# EAGLE design rapidshark_motor_lulz (EAGLE 6.5.0)
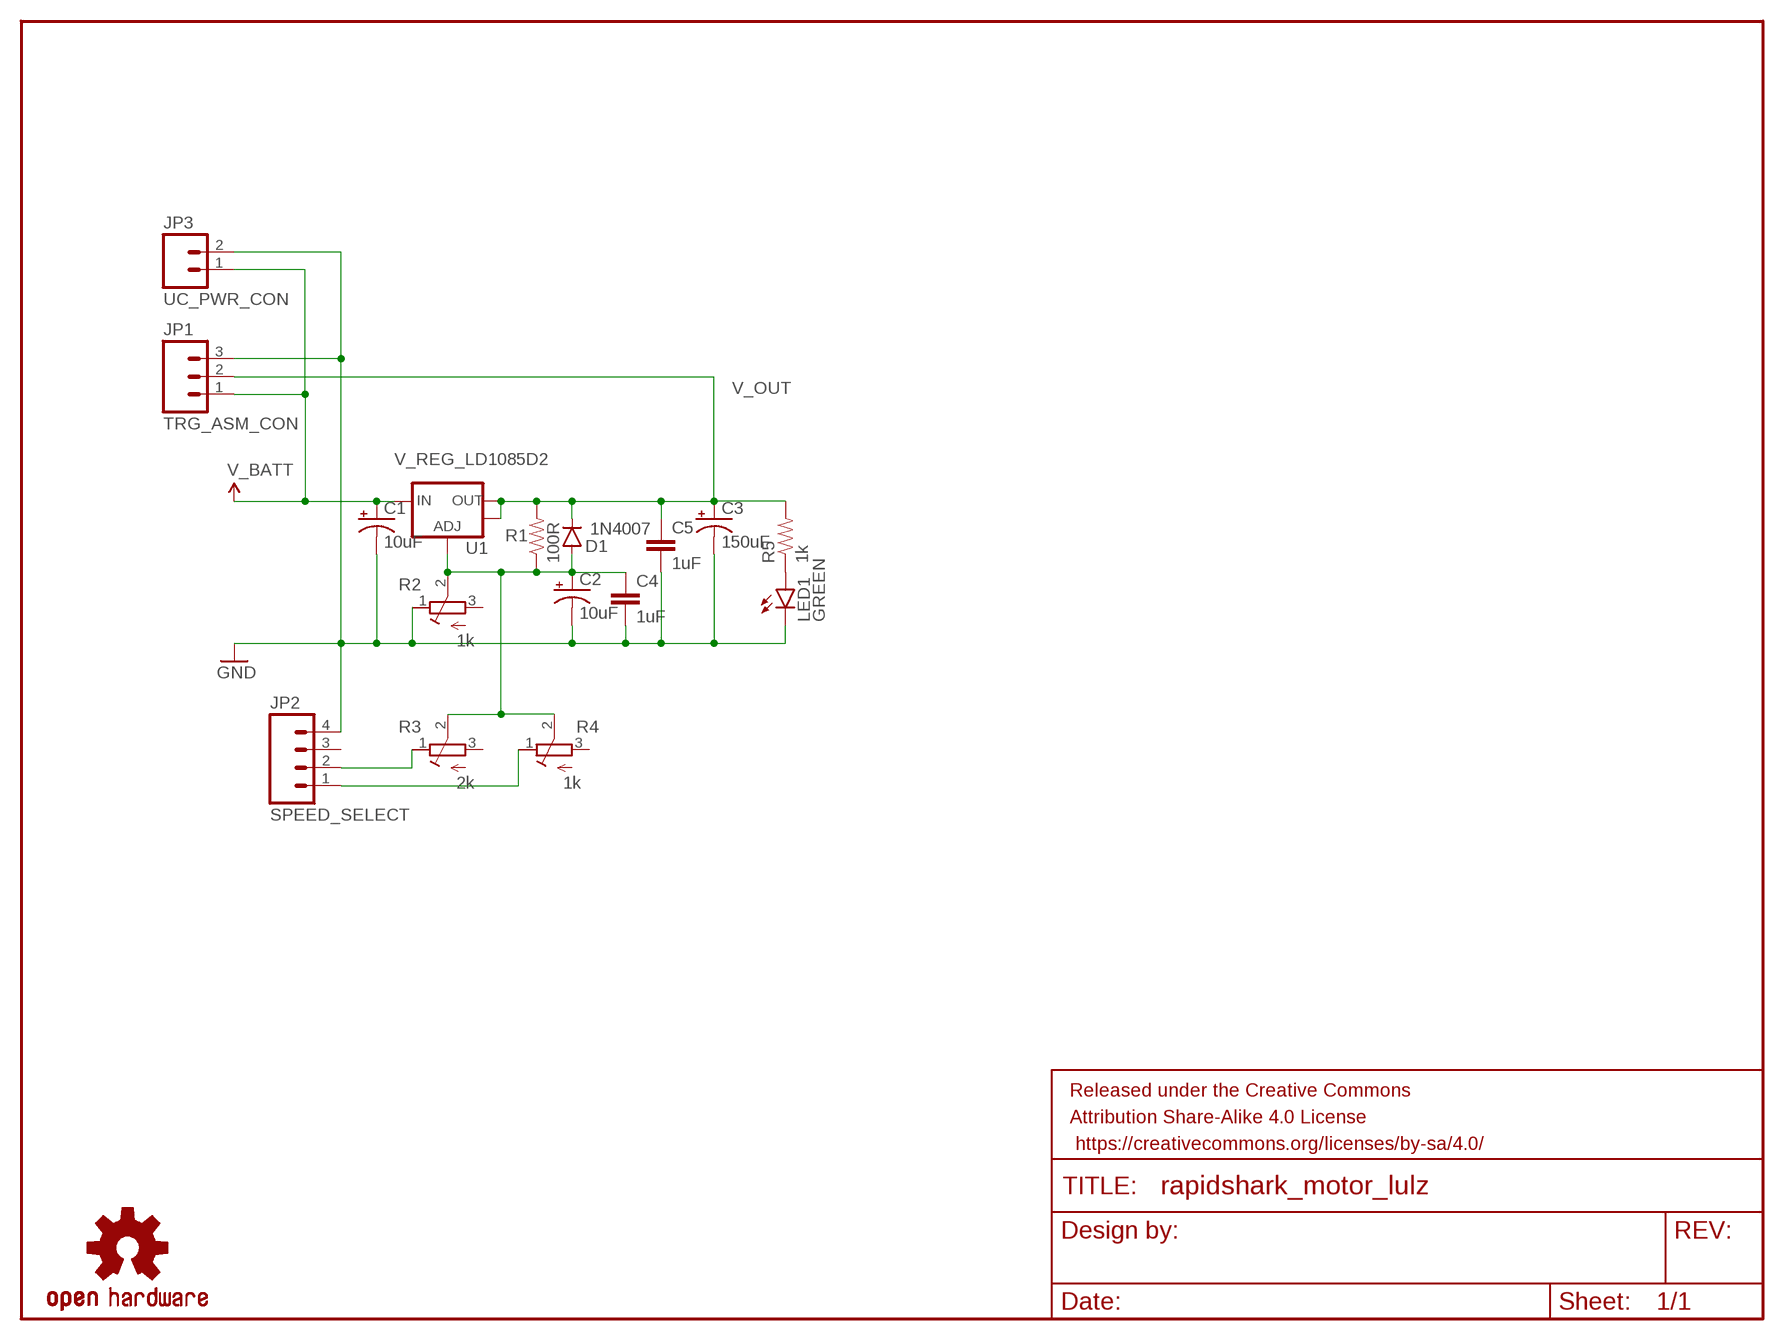
[diagram p0: schematic, sheet 1]

## Parts
C1  10uF  CPOL-USE2-5  [E2-5]
C2  10uF  CPOL-USE2-5  [E2-5]
C3  150uF  CPOL-USTT5D11L  [TT5D11L]
C4  1uF  CAPPTH  [CAP-PTH-SMALL]
C5  1uF  CAPPTH  [CAP-PTH-SMALL]
D1  1N4007  DIODEPTH  [DIODE-1N4001]
FRAME1  FRAME-LETTER  [CREATIVE_COMMONS]
JP1  TRG_ASM_CON  M03-SCREW-5MM  [SCREWTERMINAL-5MM-3]
JP2  SPEED_SELECT  M04PTH  [1X04]
JP3  UC_PWR_CON  M02PTH  [1X02]
LED1  GREEN  LED3MM  [LED3MM]
LOGO1  OSHW-LOGOS  [OSHW-LOGO-S]
R1  100R  RESISTORAXIAL-0.3  [AXIAL-0.3]
R2  1k  R-TRIMMT93XA  [RTRIMT93XA]
R3  2k  R-TRIMMT93XA  [RTRIMT93XA]
R4  1k  R-TRIMMT93XA  [RTRIMT93XA]
R5  1k  RESISTORAXIAL-0.3  [AXIAL-0.3]
U1  V_REG_LD1085D2  [D2PACK/A]

## Nets
ADJ: C2.+ C4.1 D1.A R1.P$1 R2.2(S) R3.2(S) R4.2(S) U1.1(ADJ)
GND: C1.- C2.- C3.- C4.2 C5.2 JP1.3 JP2.4 JP3.2 LED1.K(C) R2.1(A)
N$1: JP2.2 R3.1(A)
N$2: JP2.1 R4.1(A)
N$3: LED1.A R5.P$1
V_BATT: C1.+ JP1.1 JP3.1 U1.3(IN)
V_OUT: C3.+ C5.1 D1.C JP1.2 R1.P$2 R5.P$2 U1.2(OUT) U1.TAB(OUT)
Unconnected: JP2.3 R2.3(E) R3.3(E) R4.3(E)

## Library data of the parts
C1-C3 = rcl:CPOL-US: POLARIZED CAPACITOR, American symbol
C4 C5 = SparkFun-Capacitors:CAP: Capacitor Standard 0603 ceramic capacitor, and 0.1" leaded capacitor.
D1 = SparkFun-DiscreteSemi:DIODE: Diode These are standard reverse protection diodes and small signal diodes. SMA package can handle up to about 1A. SOD-323 can handle about 200mA. What the SOD-323 package when ordering, there are some mfgs out there that are 5-pin packages.
FRAME1 = SparkFun-Aesthetics:FRAME-LETTER: Schematic Frame Standard 8.5x11 US Letter frame
JP1 = SparkFun-Connectors:M03: Header 3 Standard 3-pin 0.1" header. Use with straight break away headers (SKU : PRT-00116), right angle break away headers (PRT-00553), swiss pins (PRT-00743), machine pins (PRT-00117), and female headers (PRT-00115). Molex polarized connector foot print use with SKU : PRT-08232 with associated crimp pins and housings.
JP2 = SparkFun-Connectors:M04: Header 4 Standard 4-pin 0.1" header. Use with straight break away headers (SKU : PRT-00116), right angle break away headers (PRT-00553), swiss pins (PRT-00743), machine pins (PRT-00117), and female headers (PRT-00115). Molex polarized connector foot print use with SKU : PRT-08231 with associated crimp pins and housings. 1MM SMD Version SKU: PRT-10208
JP3 = SparkFun-Connectors:M02: Standard 2-pin 0.1" header. Use with - straight break away headers ( PRT-00116) - right angle break away headers (PRT-00553) - swiss pins (PRT-00743) - machine pins (PRT-00117) - female headers (PRT-00115) Molex polarized connector foot print use with: PRT-08233 with associated crimp pins and housings. 2.54_SCREWTERM for use with PRT-10571. 3.5mm Screw Terminal footprints for PRT-08084 5mm Screw Terminal footprints for use with PRT-08433
LED1 = SparkFun-LED:LED: LEDs Standard schematic elements and footprints for 5mm, 3mm, 1206, and 0603 sized LEDs. 5mm - Spark Fun Electronics SKU : COM-00529 (and others)
LOGO1 = SparkFun-Aesthetics:OSHW-LOGO: Open Source Hardware Logo This logo indicates the piece of hardware it is found on incorporates a OSHW license and/or adheres to the definition of open source hardware found here: http://freedomdefined.org/OSHW
R1 R5 = SparkFun-Resistors:RESISTOR: Resistor Basic schematic elements and footprints for 0603, 1206, and PTH resistors.
R2-R4 = resistor:R-TRIMM: Trimm resistor
U1 = SparkFun-PowerIC:V_REG_LD1085: LD1085 3A low-drop positive voltage regulator, adjustable The LD1085xx is a low drop voltage regulator able to provide up to 3 A of output current. Dropout is guaranteed at a maximum of 1.2 V at the maximum output current, decreasing at lower loads. The LD1085xx is pin to pin compatible with the older 3-terminal adjustable regulators, but has better performances in term of drop and output tolerance. Available Packages D2PAK/A - 3-pin w/ tabs, SMD

## Board
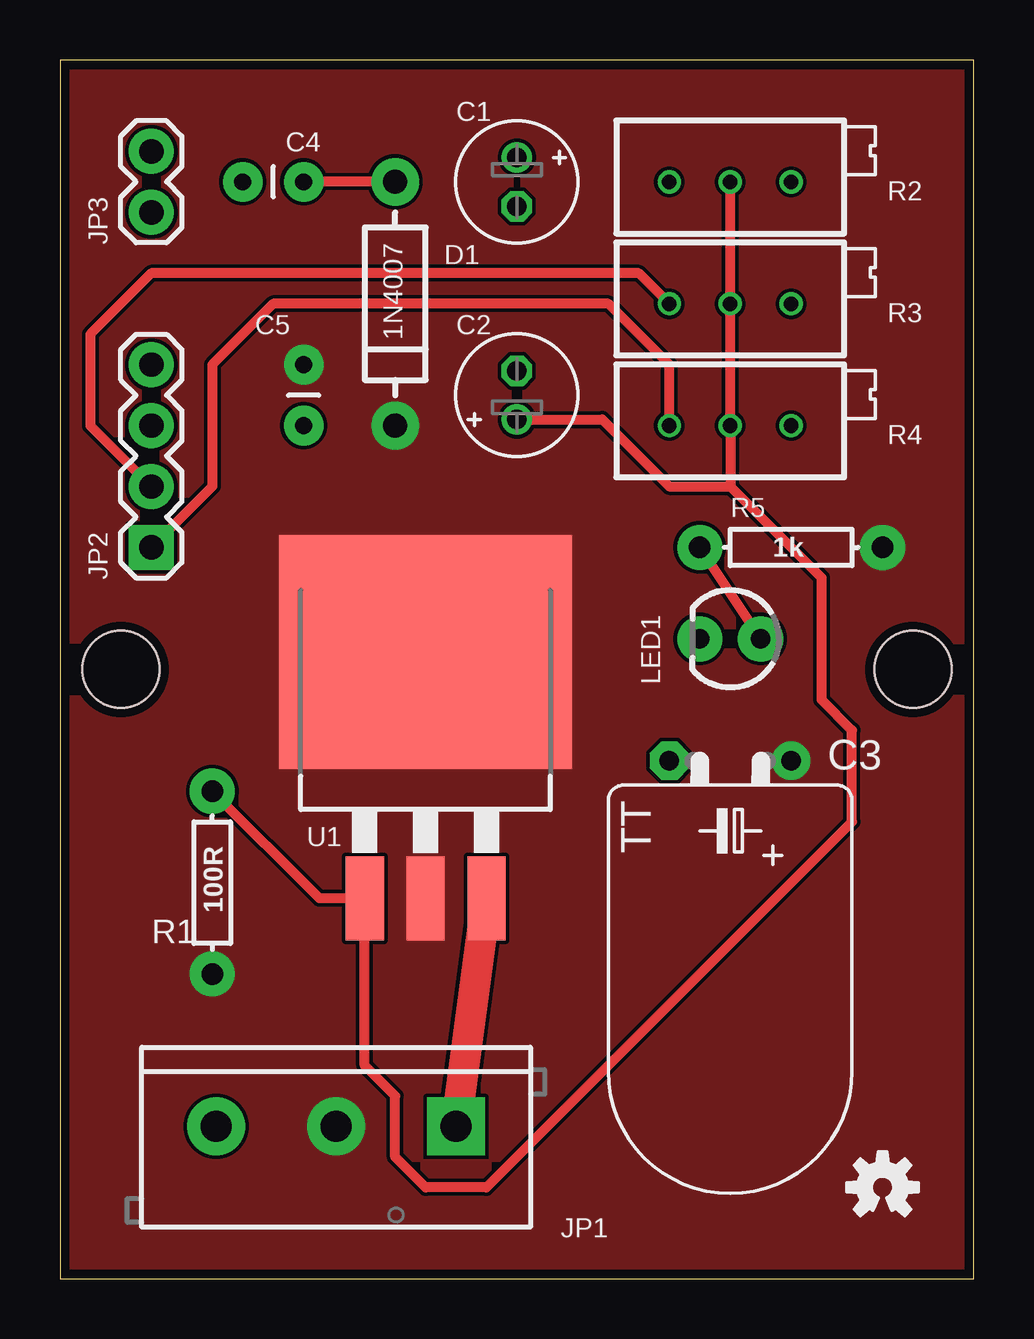
[diagram p1: board, top side]
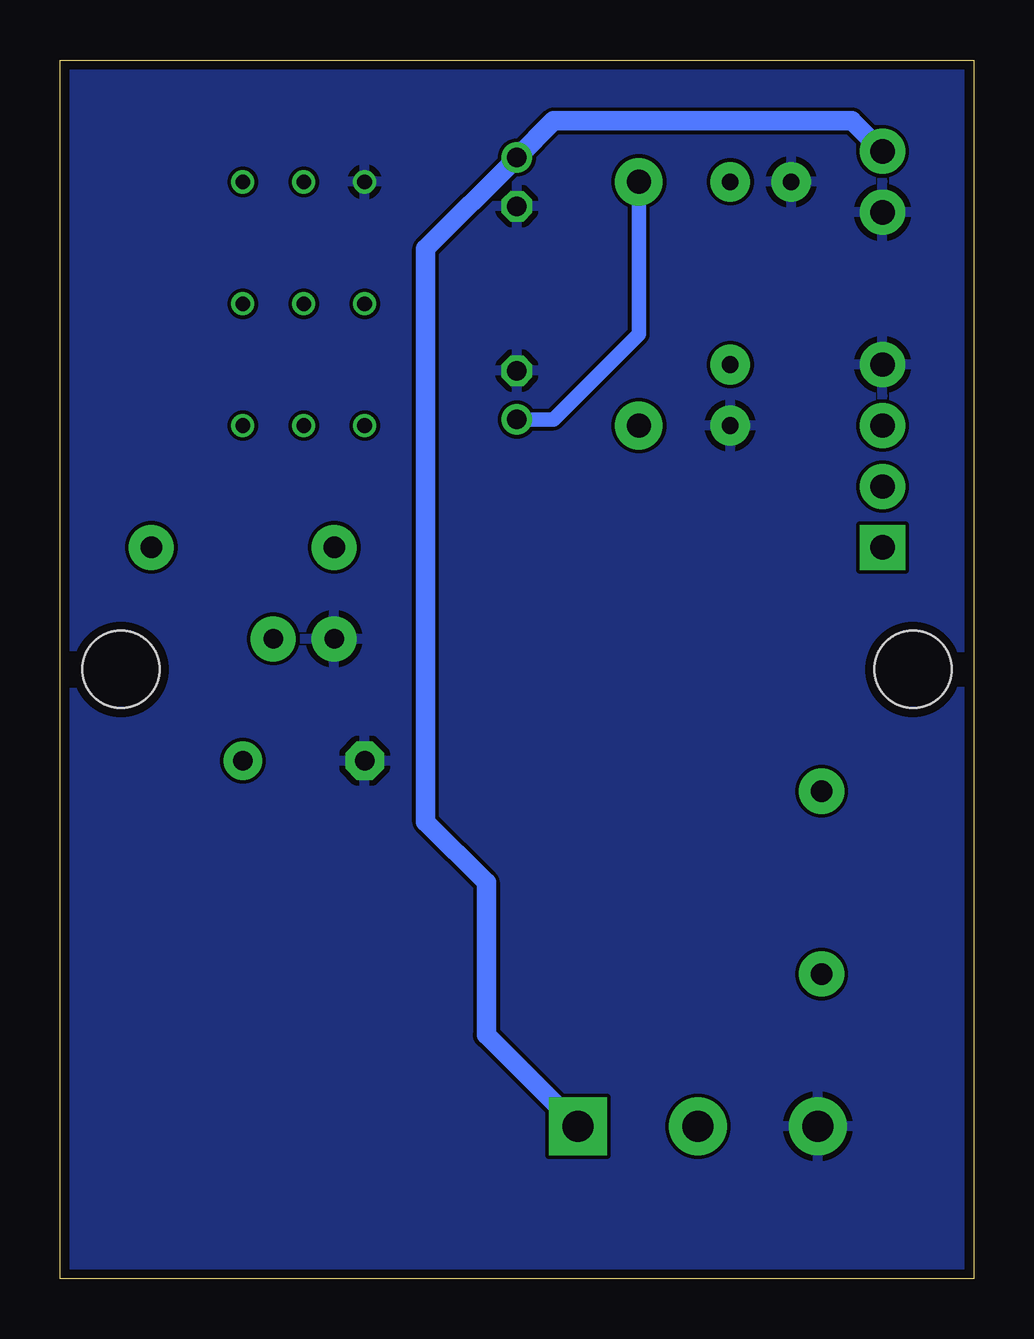
[diagram p2: board, bottom side, seen from below]

Size 38.1 x 50.8 mm. Coordinates in mm from the lower left corner, seen from the top.
Outline: 0,0 38.1,0 38.1,50.8 0,50.8 0,0
Copper layers (1*16): Top 0.0356mm / dielectric 1.5011mm / Bottom 0.0356mm
Design rules "LaenPCBOrder": minimum track width 6mil, minimum drill 13mil, track to track 6mil, track to pad 6mil, pad to pad 6mil, via to via 6mil, smd to smd 6mil, copper to edge 15mil, drill to drill 6mil, minimum pad ring 7mil, minimum via ring 7mil, stop-mask expansion 3mil, vias tented up to drill 0mil, thermal gap 10mil
Holes 3.2 mm at 35.56,25.4 2.54,25.4

### Footprints (pad centres in the part's own frame; a part is rotated, then mirrored left to right if it is on the bottom)
E2-5 = drill 0.813 pad 1.27: + -1.016,0 | drill 0.813 pad 1.27 octagon: - 1.016,0
TT5D11L = drill 0.813 pad 1.6: + -2.54,0 | drill 0.813 pad 1.6 octagon: - 2.54,0
CAP-PTH-SMALL = drill 0.7 pad 1.651: 1 0,0; 2 2.54,0
DIODE-1N4001 = drill 1 pad 1.981: A -5.08,0; C 5.08,0
SCREWTERMINAL-5MM-3 = drill 1.3 pad 2.413 square: 1 0,0 | drill 1.3 pad 2.413: 2 5,0; 3 10,0
1X04 = drill 1.016 pad 1.88 square: 1 0,0 | drill 1.016 pad 1.88: 2 2.54,0; 3 5.08,0; 4 7.62,0
1X02 = drill 1.016 pad 1.88: 1 0,0; 2 2.54,0
LED3MM = drill 0.813 pad 1.88: A -1.27,0; K 1.27,0
AXIAL-0.3 = drill 0.9 pad 1.88: P$1 -3.81,0; P$2 3.81,0
RTRIMT93XA = drill 0.61: 1 0,-2.54; 2 0,0; 3 0,2.54
D2PACK/A = smd 1.6 x 3.5: 1 -2.54,-8.275; 2 0,-8.275; 3 2.54,-8.275 | smd 12.2 x 9.75: TAB 0,2

### Placement (x,y rotation side)
C1  19.05,45.72 270 top
C2  19.05,36.83 90 top
C3  27.94,21.59 180 top
C4  10.16,45.72 180 top
C5  10.16,38.1 270 top
D1  13.97,40.64 270 top
FRAME1  2.54,-8.89 0 top  (outside the outline)
JP1  16.51,6.35 180 top
JP2  3.81,30.48 90 top
JP3  3.81,46.99 270 top
LED1  27.94,26.67 180 top
LOGO1  34.29,3.81 0 top
R1  6.35,16.51 270 top
R2  27.94,45.72 270 top
R3  27.94,40.64 270 top
R4  27.94,35.56 270 top
R5  30.48,30.48 0 top
U1  15.24,24.13 0 top

### Tracks (layer width: path | path; a pad name or v marks a point on that pad's centre or on a via)
ADJ
  Top 0.406: R1.P$1 10.81,15.86 U1.1 12.7,8.89 13.97,7.62 13.97,5.08 15.24,3.81 17.78,3.81 33.02,19.05 33.02,22.86 31.75,24.13 31.75,29.21 27.94,33.02 | R2.2 R3.2 R4.2 27.94,33.02 | D1.A C4.1 | C2.+ 22.61,35.81 25.4,33.02 27.94,33.02
  Bottom 0.61: C2.+ 17.53,35.81 13.97,39.37 D1.A
GND
  pour Bottom: 0,50.8 38.1,50.8 38.1,0 0,0
N$1
  Top 0.406: R3.1 24.13,41.91 3.81,41.91 1.27,39.37 1.27,35.56 JP2.2
N$2
  Top 0.406: R4.1 25.4,38.1 22.86,40.64 8.89,40.64 6.35,38.1 6.35,33.02 JP2.1
N$3
  Top 0.406: LED1.A R5.P$1
V_BATT
  Top 1.27: JP1.1 U1.3
  Bottom 0.813: JP3.1 5.08,48.26 17.53,48.26 C1.+ 22.86,42.93 22.86,19.05 20.32,16.51 20.32,10.16 JP1.1
V_OUT
  pour Top (no thermals): 0,50.8 38.1,50.8 38.1,0 0,0